# EAGLE design MainBoard (EAGLE 9.6.2)
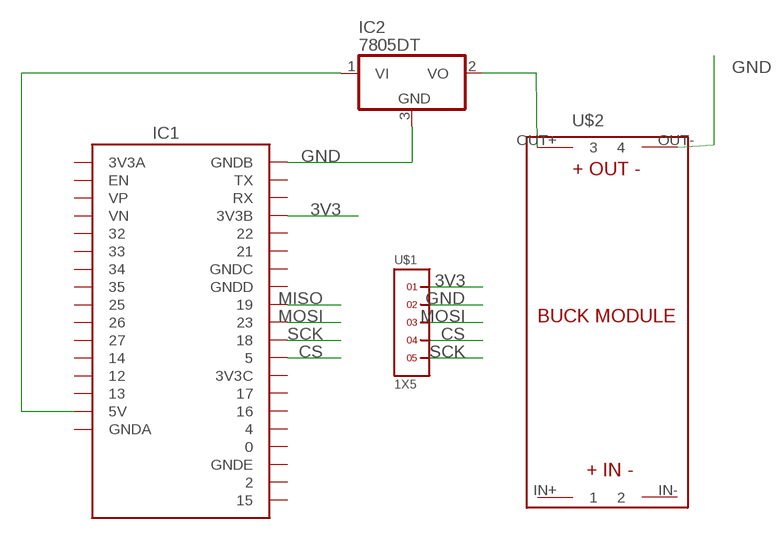
[diagram p0: schematic, sheet 1]

## Parts
IC1  SSFD_LOLIN32_WEMOS_CHINA_W_BATT  [SSFD_LOLIN32_WEMOS_CHINA_W_BATT]
IC2  7805DT  [TO252]
U$1  1X5  [1X5]
U$2  BUCK_MODULE  [BUCK_MODULE_SMALL]

## Nets
3V3: IC1.3V3B U$1.1
CS: IC1.5 U$1.4
GND: IC1.GNDB IC2.3(GND) U$1.2 U$2.OUT-
MISO: IC1.19
MOSI: IC1.23 U$1.3
N$1: IC1.5V IC2.1(VI)
N$2: IC2.2(VO) U$2.OUT+
SCK: IC1.18 U$1.5
Unconnected: IC1.0 IC1.2 IC1.3V3A IC1.3V3C IC1.4 IC1.12 IC1.13 IC1.14 IC1.15 IC1.16 IC1.17 IC1.21 IC1.22 IC1.25 IC1.26 IC1.27 IC1.32 IC1.33 IC1.34 IC1.35 IC1.EN IC1.GNDA IC1.GNDC IC1.GNDD IC1.GNDE IC1.RX IC1.TX IC1.VN IC1.VP U$2.IN+ U$2.IN-

## Library data of the parts
IC1 = SSFD - ESP32 WEMOS LOLIN CHINA W_BATT:SSFD_LOLIN32_WEMOS_CHINA_W_BATT: BY SEGASONICFAN DESIGNS HTTP://WWW.SEGASONICFAN.WIXSITE.COM/RETRO WEMOS ESP32 BREAKOUT 4MB CHINA WITH BATTERY CONNECTOR https://arduino-projekte.info/wemos-lolin32/ https://diyprojects.io/wemos-lolin32-new-development-board-esp32-e645-4mb-memory-lipo-battery-connector/
IC2 = linear:78*: Positive VOLTAGE REGULATOR Source: http://cache.national.com/ds/LM/LM78L05.pdf http://www.fairchildsemi.com/ds/LM/LM7805.pdf
U$1 = headers(2mm):1X5
U$2 = BUCK_MODULE:BUCK_MODULE

## Board
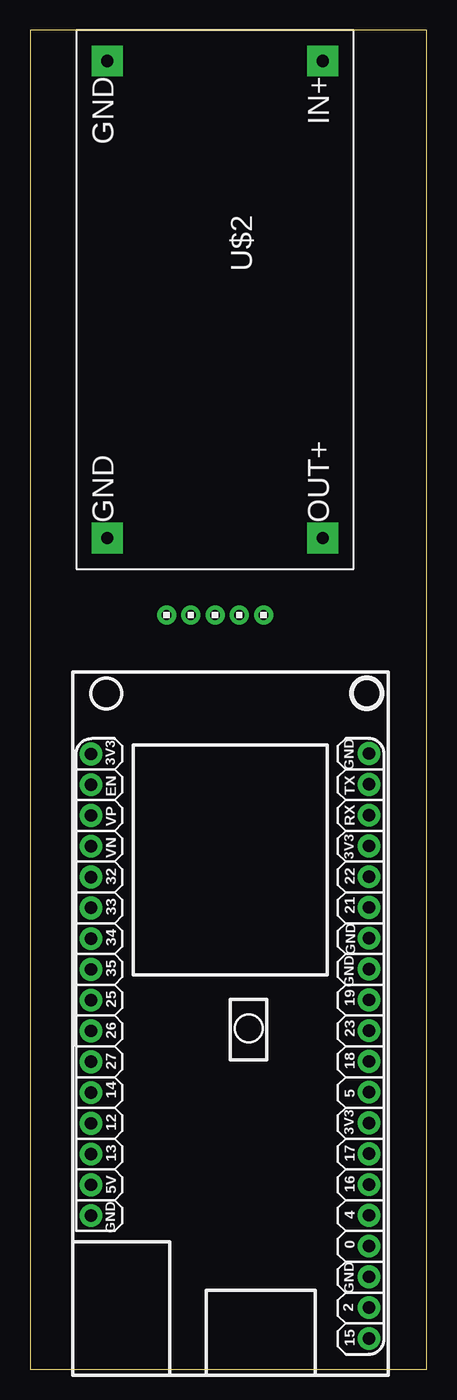
[diagram p1: board, top side]
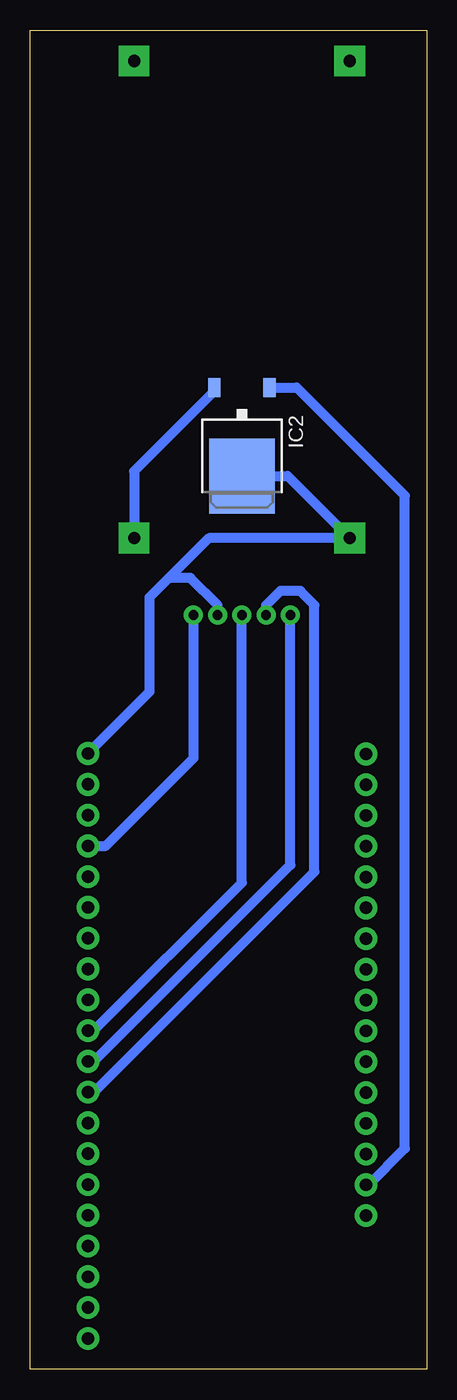
[diagram p2: board, bottom side, seen from below]

Size 32.69 x 110.48 mm. Coordinates in mm from the lower left corner, seen from the top.
Outline: 0,0 32.69,0 32.69,110.48 0,110.48 0,0
Copper layers (1*16): Top 0.035mm / dielectric 1.5mm / Bottom 0.035mm
Design rules "CNC_0.6mm": minimum track width 0.4mm, minimum drill 0.35mm, track to track 0.6mm, track to pad 0.6mm, pad to pad 0.6mm, via to via 0.6mm, smd to smd 15mil, copper to edge 0.6mm, drill to drill 0.6mm, minimum pad ring 15mil, minimum via ring 8mil, stop-mask expansion 4mil, vias tented up to drill 0mil, thermal gap 0.6mm

### Footprints (pad centres in the part's own frame; a part is rotated, then mirrored left to right if it is on the bottom)
SSFD_LOLIN32_WEMOS_CHINA_W_BATT = drill 1.016 pad 1.88: 0 11.43,-22.86; 2 11.43,-27.94; 3V3A -11.51,17.75; 3V3B 11.43,10.16; 3V3C 11.43,-12.7; 4 11.43,-20.32; 5 11.43,-10.16; 5V -11.51,-17.81; 12 -11.51,-12.73; 13 -11.51,-15.27; 14 -11.51,-10.19; 15 11.43,-30.48; 16 11.43,-17.78; 17 11.43,-15.24; 18 11.43,-7.62; 19 11.43,-2.54; 21 11.43,5.08; 22 11.43,7.62; 23 11.43,-5.08; 25 -11.51,-2.57; 26 -11.51,-5.11; 27 -11.51,-7.65; 32 -11.51,7.59; 33 -11.51,5.05; 34 -11.51,2.51; 35 -11.51,-0.03; EN -11.51,15.21; GNDA -11.51,-20.35; GNDB 11.43,17.78; GNDC 11.43,2.54; GNDD 11.43,0; GNDE 11.43,-25.4; RX 11.43,12.7; TX 11.43,15.24; VN -11.51,10.13; VP -11.51,12.67
TO252 = smd 1 x 1.6: 1 -2.28,-4.8; 2 2.28,-4.8 | smd 5.4 x 6.2: 3 0,2.5
1X5 = drill 0.8 pad 1.422: 1 -4,0; 2 -2,0; 3 0,0; 4 2,0; 5 4,0
BUCK_MODULE_SMALL = drill 1 pad 2.54 square: IN+ -20.32,8.89; IN- -20.32,-8.89; OUT+ 19.05,8.89; OUT- 19.05,-8.89

### Placement (x,y rotation side)
IC1  16.51,33.02 0 top
IC2  15.24,76.2 180 bottom
U$1  15.24,62.23 180 top
U$2  15.24,87.63 270 top

### Tracks (layer width: path | path; a pad name or v marks a point on that pad's centre or on a via)
3V3
  Bottom 0.813: U$1.1 19.24,50.4 26.46,43.18 IC1.3V3B
CS
  Bottom 0.813: U$1.4 13.24,63.04 12.06,64.22 10.42,64.22 9.25,63.05 9.25,41.05 27.45,22.86 IC1.5
GND
  Bottom 0.813: IC1.GNDB 22.86,55.88 22.86,63.68 21.25,65.29 | 21.25,65.29 17.96,68.58 U$2.OUT- 11.47,73.7 IC2.3 | U$1.2 17.24,63.04 19.49,65.29 21.25,65.29
MOSI
  Bottom 0.813: IC1.23 27.45,27.94 15.24,40.15 U$1.3
N$1
  Bottom 0.813: IC1.5V 4.79,15.21 1.78,18.21 1.78,72.07 10.71,81 IC2.1
N$2
  Bottom 0.813: IC2.2 17.52,80.7 24.13,74.09 U$2.OUT+
SCK
  Bottom 0.813: U$1.5 11.24,41.6 27.45,25.4 IC1.18